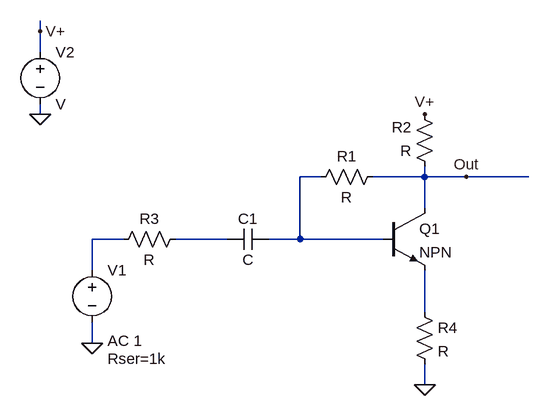
[diagram p0: schematic wzm_npn.asc]
wzm_npn.asc, the LTspice schematic file:
Version 4
SHEET 1 880 680
WIRE -352 -160 -352 -176
WIRE -352 -128 -352 -160
WIRE -352 -32 -352 -48
WIRE 80 64 48 64
WIRE 240 64 240 48
WIRE 240 64 160 64
WIRE 304 64 240 64
WIRE 400 64 304 64
WIRE 240 112 240 64
WIRE -224 160 -272 160
WIRE -64 160 -144 160
WIRE 48 160 48 64
WIRE 48 160 0 160
WIRE 176 160 48 160
WIRE -272 208 -272 160
WIRE 240 272 240 208
WIRE -272 320 -272 288
WIRE 240 384 240 352
FLAG 240 384 0
FLAG -272 320 0
FLAG -352 -32 0
FLAG -352 -160 V+
FLAG 240 -32 V+
FLAG 304 64 Out
SYMBOL npn 176 112 R0
SYMATTR InstName Q1
SYMBOL res 176 48 R90
WINDOW 0 0 56 VBottom 2
WINDOW 3 32 56 VTop 2
SYMATTR InstName R1
SYMBOL res 256 64 R180
WINDOW 0 36 76 Left 2
WINDOW 3 36 40 Left 2
SYMATTR InstName R2
SYMBOL res -240 176 R270
WINDOW 0 32 56 VTop 2
WINDOW 3 0 56 VBottom 2
SYMATTR InstName R3
SYMBOL cap 0 144 R90
WINDOW 0 0 32 VBottom 2
WINDOW 3 32 32 VTop 2
SYMATTR InstName C1
SYMBOL res 224 256 R0
SYMATTR InstName R4
SYMBOL voltage -272 192 R0
WINDOW 123 24 124 Left 2
WINDOW 39 24 152 Left 2
SYMATTR InstName V1
SYMATTR Value ""
SYMATTR Value2 AC 1
SYMATTR SpiceLine Rser=1k
SYMBOL voltage -352 -144 R0
SYMATTR InstName V2

The netlist it stands for:
* wzm_npn.asc
Q1 Out N001 N004 0 NPN
R1 Out N001 R
R2 Out V+ R
R3 N002 N003 R
C1 N001 N003 C
R4 N004 0 R
V1 N002 0 AC 1 Rser=1k
V2 V+ 0 V
.model NPN NPN
.model PNP PNP
.lib standard.bjt
.backanno
.end